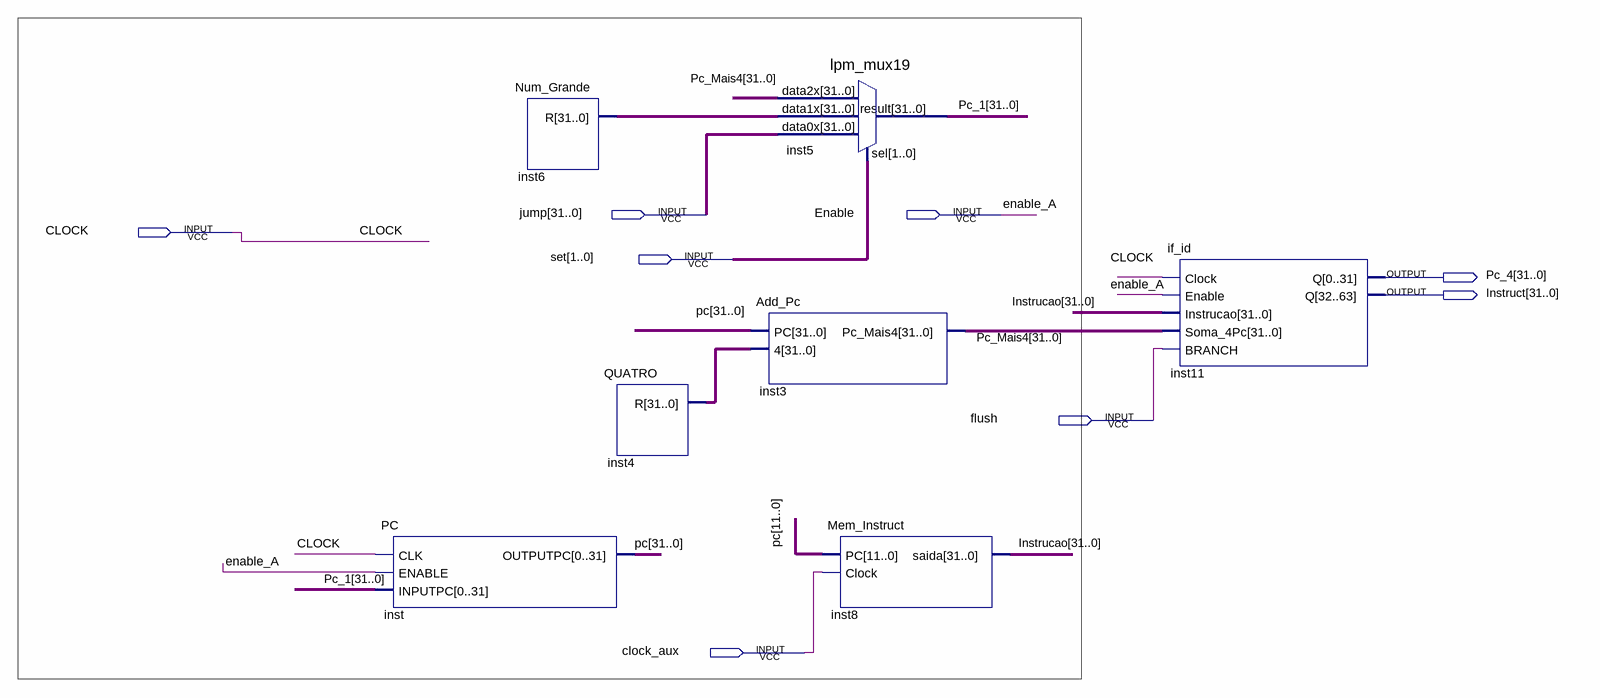
[diagram p0: schematic sheet]
// Quartus schematic Projeto_Final.bdf as structural Verilog: 7 symbols, 8 pins
module Projeto_Final (
  input  [31:0] jump,
  input  Enable,
  input  CLOCK,
  input  [1:0] set,
  input  flush,
  input  clock_aux,
  output [31:0] Pc_4,
  output [31:0] Instruct
);

  wire [31:0] inst4_r, inst6_r, Instrucao, pc, Pc_1, Pc_Mais4;

  PC inst (.CLK(CLOCK), .ENABLE(Enable), .INPUTPC(Pc_1), .OUTPUTPC(pc));
  Num_Grande inst6 (.R(inst6_r));
  QUATRO inst4 (.R(inst4_r));
  lpm_mux19 inst5 (.data2x(Pc_Mais4), .data1x(inst6_r), .data0x(jump), .sel(set), .result(Pc_1));
  Add_Pc inst3 (.PC(pc), .\4 (inst4_r), .Pc_Mais4(Pc_Mais4));
  Mem_Instruct inst8 (.PC(pc[11:0]), .Clock(clock_aux), .saida(Instrucao));
  if_id inst11 (
    .Clock(CLOCK), .Enable(Enable), .Instrucao(Instrucao), .Soma_4Pc(Pc_Mais4), .BRANCH(flush),
    .Q({Instruct[0], Instruct[1], Instruct[2], Instruct[3], Instruct[4], Instruct[5], Instruct[6], Instruct[7], Instruct[8], Instruct[9], Instruct[10], Instruct[11], Instruct[12], Instruct[13], Instruct[14], Instruct[15], Instruct[16], Instruct[17], Instruct[18], Instruct[19], Instruct[20], Instruct[21], Instruct[22], Instruct[23], Instruct[24], Instruct[25], Instruct[26], Instruct[27], Instruct[28], Instruct[29], Instruct[30], Instruct[31], Pc_4[0], Pc_4[1], Pc_4[2], Pc_4[3], Pc_4[4], Pc_4[5], Pc_4[6], Pc_4[7], Pc_4[8], Pc_4[9], Pc_4[10], Pc_4[11], Pc_4[12], Pc_4[13], Pc_4[14], Pc_4[15], Pc_4[16], Pc_4[17], Pc_4[18], Pc_4[19], Pc_4[20], Pc_4[21], Pc_4[22], Pc_4[23], Pc_4[24], Pc_4[25], Pc_4[26], Pc_4[27], Pc_4[28], Pc_4[29], Pc_4[30], Pc_4[31]}));

  // Other names for the same wires on the sheet: enable_A = Enable
endmodule
